# EAGLE design Position_potmeter (EAGLE 7.7.0)
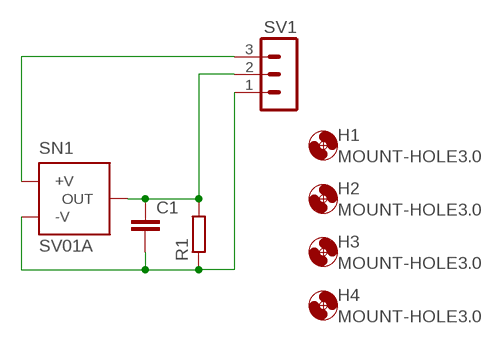
[diagram p0: schematic, sheet 1]

## Parts
C1  C-EUC0805K  [C0805K]
H1  MOUNT-HOLE3.0  [3,0]
H2  MOUNT-HOLE3.0  [3,0]
H3  MOUNT-HOLE3.0  [3,0]
H4  MOUNT-HOLE3.0  [3,0]
R1  R-EU_M0805  [M0805]
SN1  SV01A  [SV01A]
SV1  MA03-1  [MA03-1]

## Nets
N$1: SN1.3(+V) SV1.3
N$2: C1.1 R1.2 SN1.2(OUT) SV1.2
N$3: C1.2 R1.1 SN1.1(-V) SV1.1

## Library data of the parts
C1 = rcl:C-EU: CAPACITOR, European symbol
H1-H4 = holes:MOUNT-HOLE: MOUNTING HOLE with drill center marker
R1 = rcl:R-EU_: RESISTOR, European symbol
SN1 = murata-sensor:SV01: Rotary Position Sensors SMD/Lead Dust-proof Type 12mm Size SV01 Series Source: http://www.murata.com/catalog/r50/el0595.pdf; OC_FARNELL: 1406648; OC_NEWARK: unknown
SV1 = con-lstb:MA03-1: PIN HEADER; OC_FARNELL: unknown; OC_NEWARK: unknown

## Board
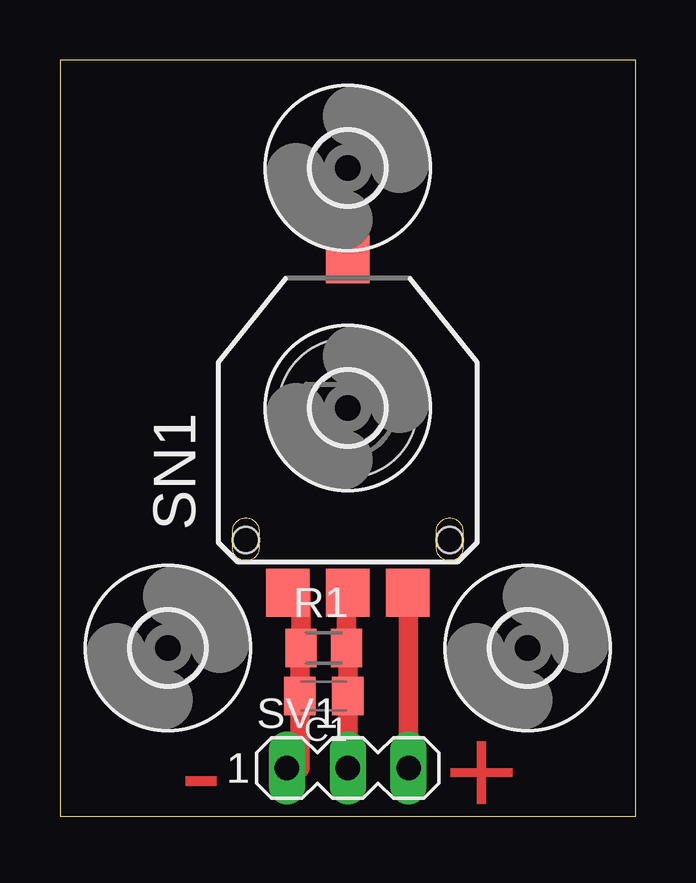
[diagram p1: board, top side]

Size 24 x 31.5 mm. Coordinates in mm from the lower left corner, seen from the top.
Outline: 0,0 24,0 24,31.5 0,31.5 0,0
Copper layers (1*16): Top 0.035mm / dielectric 1.5mm / Bottom 0.035mm
Design rules "default": minimum track width 10mil, minimum drill 24mil, track to track 8mil, track to pad 8mil, pad to pad 8mil, via to via 8mil, smd to smd 8mil, copper to edge 40mil, drill to drill 8mil, minimum pad ring 10mil, minimum via ring 8mil, stop-mask expansion 4mil, vias tented up to drill 0mil, thermal gap 10mil

### Footprints (pad centres in the part's own frame; a part is rotated, then mirrored left to right if it is on the bottom)
C0805K = smd 1.3 x 1.6: 1 -1,0; 2 1,0
3,0 = hole 3: 0,0
M0805 = smd 1.3 x 1.6: 1 -0.95,0; 2 0.95,0
SV01A = smd 1.8 x 2: 1 -2.5,-7.7; 2 0,-7.7; 2@1 0,6.2; 3 2.5,-7.7 | hole 5.8: 0,0 | hole 1.1: 4.25,-5.5; -4.25,-5.5
MA03-1 = drill 1.016 long: 1 -2.54,0; 2 0,0; 3 2.54,0

### Placement (x,y rotation side)
C1  11,5 180 top
H1  12,17 0 top
H2  19.5,7 0 top
H3  4.5,7 0 top
H4  12,27 0 top
R1  11,7 0 top
SN1  12,17 0 top
SV1  12,2 0 top

### Tracks (layer width: path | path; a pad name or v marks a point on that pad's centre or on a via)
N$1
  Top 0.813: SN1.3 14.54,9.3 SV1.3
N$2
  Top 0.813: SN1.2 11.95,9.3 R1.2 12,7 C1.1 SV1.2
N$3
  Top 0.813: SN1.1 10.05,9.3 R1.1 10,7 C1.2 10,2 SV1.1

### Text on the board
Top: - | +